# Altium project ife19_TS_BMSSlave_LTC6811v2.PrjPcb
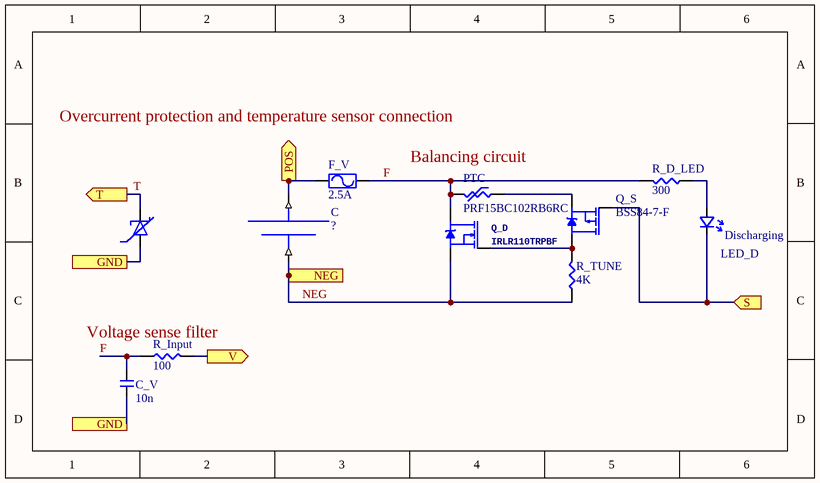
[diagram p0: Cell.SchDoc]
3 sheets, 115 parts. Net scope: hierarchical (ports join the sheet entries above them; power ports are global).
Board file: Slave.PcbDoc
Sheets:
  Cell.SchDoc
  Slave.SchDoc
    P = Half_Slave.SchDoc
    N = Half_Slave.SchDoc

## Sheet Cell.SchDoc
size 152 x 88 mm

### Parts
C  ?  [Li1x7pVTC6T]
C_V  10n  [CAP-0603]
F_V  2.5A  [FUSE1206]
LED_D  Discharging  [LED-0603]
PTC  PRF15BC102RB6RC  [NTC-0603]
Q_D  IRLR110TRPBF  [TO252]
Q_S  BSS84-7-F  [SOT23]
R_D_LED  300  [RES-0603]
R_Input  100  [RES-0603]
R_TUNE  4K  [RES-0603]

### Ports
GND, NEG (in), POS (out), S (in), T (out), V (out)

### Nets
F: C_V.2 F_V.2 PTC.2 Q_D.2(D) R_D_LED.2 R_Input.1
NEG: C.- Q_D.3(S) R_TUNE.1 ; port NEG
T: C.T+ ; port T
NetC_+: C.+ F_V.1 ; port POS
NetC_T-: C.T- C_V.1 ; port GND
NetLED_D_A: LED_D.A R_D_LED.1
NetLED_D_K: LED_D.K Q_S.1(G) ; port S
NetPTC_1: PTC.1 Q_S.2(S)
NetQ_D_1: Q_D.1(G) Q_S.3(D) R_TUNE.2
NetR_Input_2: R_Input.2 ; port V

### Notes on the sheet
- Overcurrent protection and temperature sensor connection
- Balancing circuit
- (near R_Input) Voltage sense filter

### Library data of the parts
C = Li1x7pVTC6T
C_V = CAP-0603
F_V = FUSE-1206
LED_D = LED-0603
PTC = NTC-0603
Q_D = NMOS-TO252: GateName_1: G$1; SymbolName_1: LABELED-PMOS; DeviceSetName: DMP10H400SK3-13; LibraryName: IFE_Transistors; Package: TO252
Q_S = PMOS-SOT23
R_D_LED R_Input R_TUNE = RES-0603

## Sheet Slave.SchDoc
size A
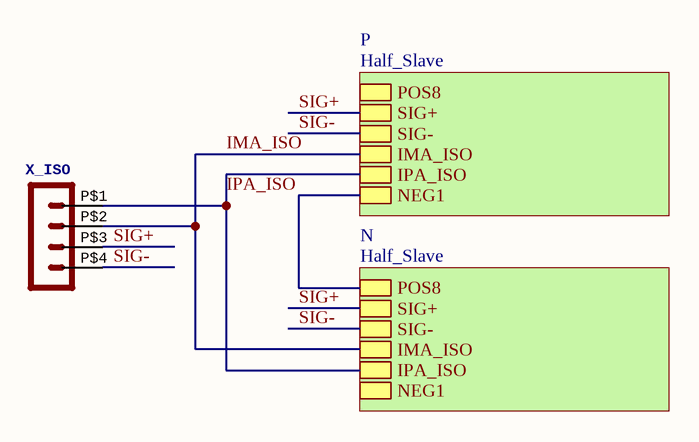
[diagram p1: Slave.SchDoc]

### Parts
X_ISO  Molex - Micro-Fit 3.0 Series connector,  3.00mm (0.118") pitch header, 4 positions.  [43650-0424]  (value not drawn)

### Sub-sheets
N = Half_Slave: POS8, IMA_ISO, IPA_ISO, NEG1, SIG+, SIG-
P = Half_Slave: POS8, IMA_ISO, IPA_ISO, NEG1, SIG+, SIG-

### Nets
IMA_ISO: X_ISO.P$2 ; sheet P/IMA_ISO, sheet N/IMA_ISO
IPA_ISO: X_ISO.P$1 ; sheet P/IPA_ISO, sheet N/IPA_ISO
NEG1: sheet P/NEG1, sheet N/POS8
SIG+: X_ISO.P$3 ; sheet P/SIG+, sheet N/SIG+
SIG-: X_ISO.P$4 ; sheet P/SIG-, sheet N/SIG-

### Library data of the parts
X_ISO = POS4_MF43650-0424: GateName_1: G$1; SymbolName_1: HEADER_POS4; DeviceSetName: HEADER_POS4_?; DeviceName: 43650-0424; LibraryName: MOLEX Micro-Fit; Package: 43650-0424

## Sheet Half_Slave.SchDoc
size B
Used 2 times, as channels P, N. Parts and nets are listed once, with the designators drawn on the sheet.
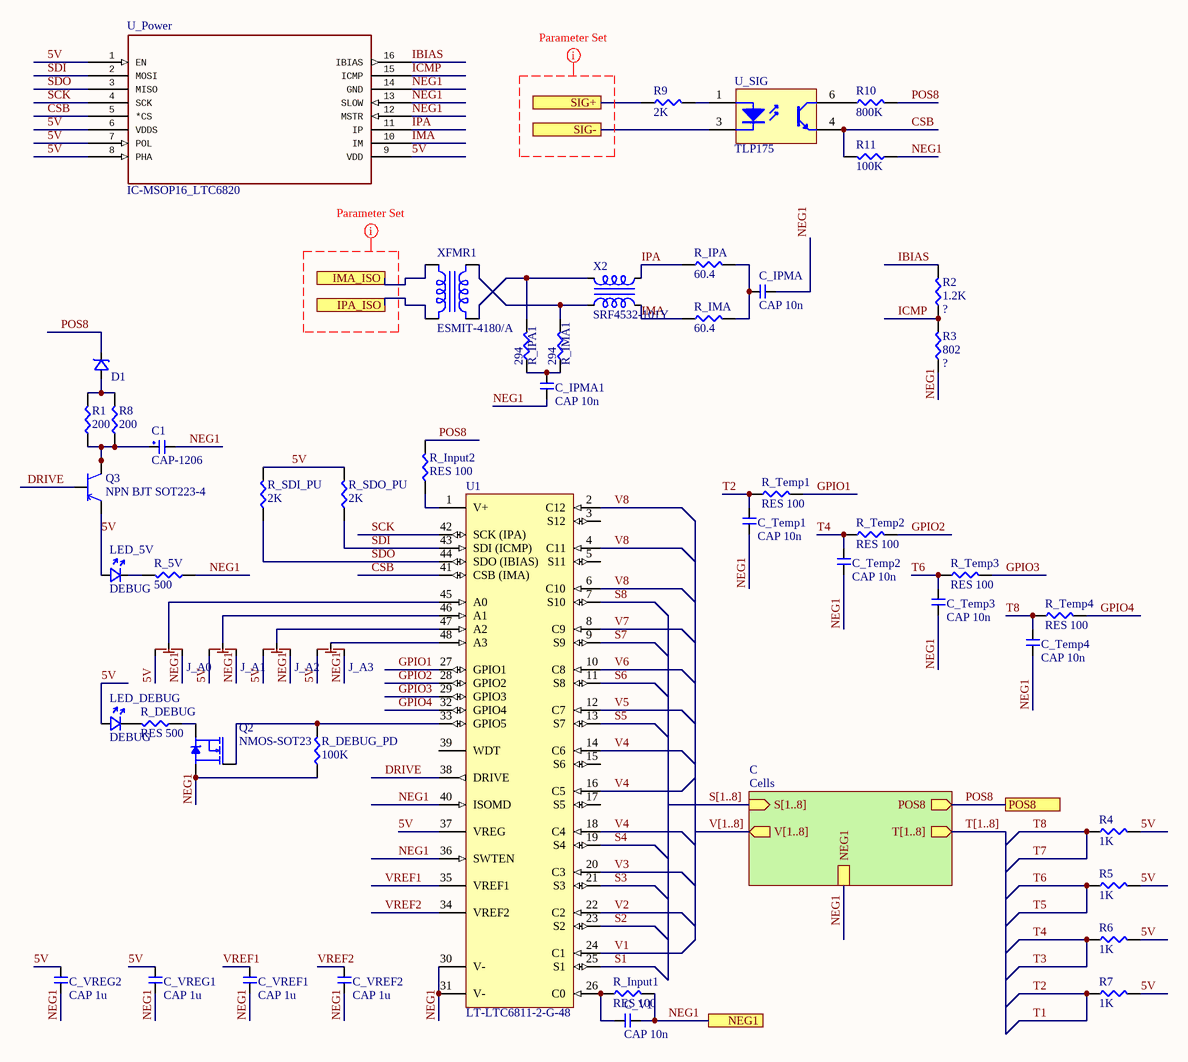
[diagram p2: Half_Slave.SchDoc]

### Parts
C1  CAP-1206  [CAPCP3216X16N]
C_IPMA  CAP 10n  [CAP-0603]
C_IPMA1  CAP 10n  [CAP-0603]
C_Temp1  CAP 10n  [CAP-0603]
C_Temp2  CAP 10n  [CAP-0603]
C_Temp3  CAP 10n  [CAP-0603]
C_Temp4  CAP 10n  [CAP-0603]
C_V1  CAP 10n  [CAP-0603]
C_VREF1  CAP 1u  [CAP-0603]
C_VREF2  CAP 1u  [CAP-0603]
C_VREG1  CAP 1u  [CAP-0603]
C_VREG2  CAP 1u  [CAP-0603]
D1  ?  [SMB]  (value not drawn)
J_A0  DPDT Solder Jumper  [DPDT Solder]  (value not drawn)
J_A1  DPDT Solder Jumper  [DPDT Solder]  (value not drawn)
J_A2  DPDT Solder Jumper  [DPDT Solder]  (value not drawn)
J_A3  DPDT Solder Jumper  [DPDT Solder]  (value not drawn)
LED_5V  DEBUG  [LED-0603]
LED_DEBUG  DEBUG  [LED-0603]
Q2  NMOS-SOT23  [SOT23]
Q3  NPN BJT SOT223-4  [SOT223]
R1  200  [RES-0603]
R2  1.2K  [RES-0603]
R3  802  [RES-0603]
R4  1K  [RES-0603]
R5  1K  [RES-0603]
R6  1K  [RES-0603]
R7  1K  [RES-0603]
R8  200  [RES-0603]
R9  2K  [RES-0603]
R10  800K  [RES-0603]
R11  100K  [RES-0603]
R_5V  500  [RES-0603]
R_DEBUG  RES 500  [RES-0603]
R_DEBUG_PD  100K  [RES-0603]
R_IMA  60.4  [RES-0603]
R_IMA1  294  [RES-0603]
R_Input1  RES 100  [RES-0603]
R_Input2  RES 100  [RES-0603]
R_IPA  60.4  [RES-0603]
R_IPA1  294  [RES-0603]
R_SDI_PU  2K  [RES-0603]
R_SDO_PU  2K  [RES-0603]
R_Temp1  RES 100  [RES-0603]
R_Temp2  RES 100  [RES-0603]
R_Temp3  RES 100  [RES-0603]
R_Temp4  RES 100  [RES-0603]
U1  LT-LTC6811-2-G-48  [SSOP-48N]
U_Power  IC-MSOP16_LTC6820  [MSOP16]
U_SIG  TLP175  [TOSH-11-4C1_N]
X2  SRF4532-101Y  [SRF4532]
XFMR1  ESMIT-4180/A  [ISOXFMR_ESMIT4180]

### Sub-sheets
C = Cells (file not in this document): S[1..8] (in), POS8 (out), T[1..8] (out), V[1..8] (out), NEG1

### Ports
IMA_ISO, IPA_ISO, NEG1, POS8, SIG+, SIG-

### Nets
5V: C_VREG1.2 C_VREG2.2 J_A0.2 J_A1.2 J_A2.2 J_A3.2 LED_5V.A LED_DEBUG.A Q3.3(E) R4.2 R5.2 R6.2 R7.2 R_SDI_PU.2 R_SDO_PU.2 U1.37(VREG) U_Power.1(EN) U_Power.6(VDDS) U_Power.7(POL) U_Power.8(PHA) U_Power.9(VDD)
CSB: R11.2 U1.41(CSB_(IMA)) U_Power.5(*CS) U_SIG.4(EMITTER)
DRIVE: Q3.1(B) U1.38(DRIVE)
GPIO1: R_Temp1.2 U1.27(GPIO1)
GPIO2: R_Temp2.2 U1.28(GPIO2)
GPIO3: R_Temp3.2 U1.29(GPIO3)
GPIO4: R_Temp4.2 U1.32(GPIO4)
IBIAS: R2.2 U_Power.16(IBIAS)
ICMP: R2.1 R3.2 U_Power.15(ICMP)
IMA: R_IMA.2 U_Power.10(IM) X2.4
IMA_ISO: XFMR1.2 ; port IMA_ISO
IPA: R_IPA.2 U_Power.11(IP) X2.1
IPA_ISO: XFMR1.1 ; port IPA_ISO
NEG1: C1.2 C_IPMA.1 C_IPMA1.1 C_Temp1.1 C_Temp2.1 C_Temp3.1 C_Temp4.1 C_V1.1 C_VREF1.1 C_VREF2.1 C_VREG1.1 C_VREG2.1 J_A0.1 J_A1.1 J_A2.1 J_A3.1 Q2.2(S) R3.1 R11.1 R_5V.1 R_DEBUG_PD.1 R_Input1.2 U1.30(V-) U1.31(V-) U1.36(SWTEN) U1.40(ISOMD) U_Power.12(MSTR) U_Power.13(SLOW) U_Power.14(GND) ; port NEG1, sheet C/NEG1
POS8: D1.K R10.2 R_Input2.2 ; port POS8, sheet C/POS8
S1: U1.25(S1)
S2: U1.23(S2)
S3: U1.21(S3)
S4: U1.19(S4)
S5: U1.13(S7)
S6: U1.11(S8)
S7: U1.9(S9)
S8: U1.7(S10)
SCK: U1.42(SCK_(IPA)) U_Power.4(SCK)
SDI: R_SDO_PU.1 U1.43(SDI_(ICMP)) U_Power.2(MOSI)
SDO: R_SDI_PU.1 U1.44(SDO_(IBIAS)) U_Power.3(MISO)
SIG+: R9.1 ; port SIG+
SIG-: U_SIG.3(CATHODE) ; port SIG-
T1: C_Temp1.2 R7.1 R_Temp1.1  [also labelled T2]
T3: C_Temp2.2 R6.1 R_Temp2.1  [also labelled T4]
T5: C_Temp3.2 R5.1 R_Temp3.1  [also labelled T6]
T7: C_Temp4.2 R4.1 R_Temp4.1  [also labelled T8]
V1: U1.24(C1)
V2: U1.22(C2)
V3: U1.20(C3)
V4: U1.14(C6) U1.16(C5) U1.18(C4)
V5: U1.12(C7)
V6: U1.10(C8)
V7: U1.8(C9)
V8: U1.2(C12) U1.4(C11) U1.6(C10)
VREF1: C_VREF1.2 U1.35(VREF1)
VREF2: C_VREF2.2 U1.34(VREF2)
NetC1_1: C1.1 Q3.2(C) Q3.4(C) R1.1 R8.1
NetC_IPMA1_2: C_IPMA1.2 R_IMA1.1 R_IPA1.1
NetC_IPMA_2: C_IPMA.2 R_IMA.1 R_IPA.1
NetC_V1_2: C_V1.2 R_Input1.1 U1.26(C0)
NetD1_A: D1.A R1.2 R8.2
NetJ_A0_3: J_A0.3 U1.45(A0)
NetJ_A1_3: J_A1.3 U1.46(A1)
NetJ_A2_3: J_A2.3 U1.47(A2)
NetJ_A3_3: J_A3.3 U1.48(A3)
NetLED_5V_K: LED_5V.K R_5V.2
NetLED_DEBUG_K: LED_DEBUG.K R_DEBUG.2
NetQ2_1: Q2.1(G) R_DEBUG_PD.2 U1.33(GPIO5)
NetQ2_3: Q2.3(D) R_DEBUG.1
NetR9_2: R9.2 U_SIG.1(ANODE)
NetR10_1: R10.1 U_SIG.6(COLLECTOR)
NetR_IMA1_2: R_IMA1.2 X2.3 XFMR1.3
NetR_Input2_1: R_Input2.1 U1.1(V+)
NetR_IPA1_2: R_IPA1.2 X2.2 XFMR1.4

Not connected (* = marked no-connect by the designer): U1 3(S12) 5(S11) 15(S6) 17(S5) 39(WDT)

### Channels
P: designators end in _P; ports IMA_ISO=IMA_ISO IPA_ISO=IPA_ISO NEG1=NEG1 POS8=POS8_P SIG+=SIG+ SIG-=SIG-
N: designators end in _N; ports IMA_ISO=IMA_ISO IPA_ISO=IPA_ISO NEG1=NEG1_N POS8=NEG1 SIG+=SIG+ SIG-=SIG-

### Buses and harness runs
bus S[1..8] = sheet C/S[1..8]
bus T[1..8] = sheet C/T[1..8]
bus V[1..8] = sheet C/V[1..8]

### Layout directives
rule Clearance Constraint [Clearance = 32mil]; net class ISO: (no net found under the mark)

### Library data of the parts
C_IPMA C_IPMA1 C_Temp1-C_Temp4 C_V1 C_VREF1 C_VREF2 C_VREG1 C_VREG2 = CAP-0603
D1 = DIODE-SMB
J_A0-J_A3 = DPDT Solder
LED_5V LED_DEBUG = LED-0603
Q3 = NPN_SOT223-4: BCP54,115
R1 R4-R11 R_5V R_DEBUG R_DEBUG_PD R_IMA R_IMA1 R_Input1 R_Input2 R_IPA R_IPA1 R_SDI_PU R_SDO_PU R_Temp1-R_Temp4 = RES-0603
R2 R3 = RES_0603: RES SMD 0603; Company: IFE; Part: RES_0603; Value: ?; Package: 0603
U_SIG = CMP-2000-07256-1: Optocoupler DC-IN 1-CH Transistor DC-OUT, 16 mA, 5 V, -55 to 110 degC, 4-Pin SOP, RoHS, Tape and Reel; Manufacturer: Toshiba; Voltage - Isolation: 3750Vrms; Current - Output / Channel: 50mA; Current Transfer Ratio (Min): 100%@5mA; Input Type: DC; Vce Saturation (Max): 400mV; Current Transfer Ratio (Max): 600%@5mA; Rise / Fall Time (Typ): 2µs,3µs; Number of Channels: 1; Turn On / Turn Off Time (Typ): 3µs,3µs; Voltage - Output (Max): 80V; Voltage - Forward (Vf) (Typ): 1.15V; Other Names: TLP181(GB-TPLF)TLP181(GB-TPLFT)TLP181(GB-TPLFT)-ND; Supplier Device Package: 6-MFSOP,4Lead; Output Type: Transistor; Operating Temperature: -55°C~110°C; Category: Isolators; Datasheet Version: 11/2009; Package / Case: 6-SMD(4Leads),GullWing; Packaging: Tape&Reel(TR); Datasheet URL: https://datasheet.ciiva.com/6573/tlp181-datasheet-en-20091112-6573825.pdf; Family: Optoisolators-Transistor,PhotovoltaicOutput; Package Reference: 11-4C1; Manufacturer URL: http://www.toshiba.com/; Mounting Type: SurfaceMount; Standard Package: 3,000; Current - DC Forward (If) (Max): 50mA; Mounting Technology: SurfaceMount; Series: -; Package Description: 4-Pin Small Outline Package Integrated Circuit, Body 3.6 x 4.4 mm, Pitch 2.54 mm
X2 = CMC_SRF4532
XFMR1 = ISOXFMR_ESMIT4180

## Nets that join several sheets
IMA_ISO: Slave (X_ISO.P$2), P (XFMR1_P.2), N (XFMR1_N.2)
IPA_ISO: Slave (X_ISO.P$1), P (XFMR1_P.1), N (XFMR1_N.1)
NEG1: P (29 pins), N (D1_N.K R10_N.2 R_Input2_N.2)
SIG+: Slave (X_ISO.P$3), P (R9_P.1), N (R9_N.1)
SIG-: Slave (X_ISO.P$4), P (U_SIG_P.3), N (U_SIG_N.3)